# Altium schematic sheet Switch.SchDoc
size A; SheetNumber: 4; SheetTotal: 4
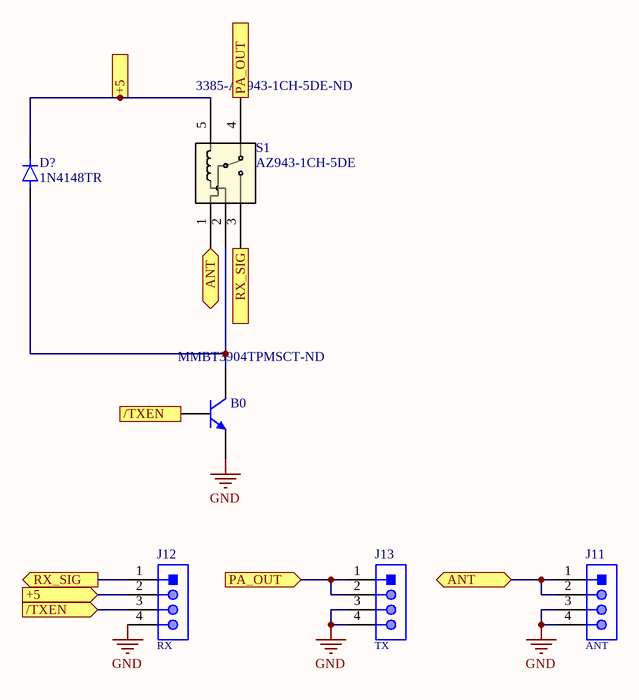
[diagram p0: Switch.SchDoc]

## Parts
B0  Supplier Part Number 1: MMBT3904TPMSCT-ND  (hidden comment: Bipolar NPN 3 Pins Transistor VBIC Model)
D?  1N4148TR  [DIOAD753W49L380D172B]
J11  ANT  [61300411121]
J12  RX  [61300411121]
J13  TX  [61300411121]
S1  AZ943-1CH-5DE  Supplier Part Number 1: 3385-AZ943-1CH-5DE-ND  [K_AZ943-1C_AMZ]

## Ports
+5 (in), /TXEN (in), ANT (bidir), PA_OUT (in), RX_SIG (out)

## Nets
GND: B0.3(E) J11.3 J11.4 J12.4 J13.3 J13.4
+5: D?.K J12.2 S1.5 ; port +5
/TXEN: B0.2(B) J12.3 ; port /TXEN
ANT: J11.1 J11.2 S1.1 ; port ANT
PA_OUT: J13.1 J13.2 S1.4 ; port PA_OUT
RX_SIG: J12.1 S1.3 ; port RX_SIG
NetB0_1: B0.1(C) D?.A S1.2

## Library data of the parts
B0 = BJT NPN VBIC: Small Signal Bipolar Transistor, 0.2A I(C), 40V V(BR)CEO, 1-Element, NPN, Silicon; Manufacturer: MCC; Manufacturer Part Number: MMBT3904-TP; SimulationGenericComponent: True; AFN: 1; AJC: -0.5; ART: 0.1; AVC1: 0; EA: 1.12; FC: 0.9; IBBE: 1e-06; IBCI: 1e-16; IBEI: 1e-18; MC: 0.33; NCN: 2; NKF: 0.5; PC: 0.75; TNOM: 27; VERS: 1.2; XII: 3; Package Body Material: Plastic; Max Collector Current: 200mA; DC Current Gain-Min (hFE): 30; Power Dissipation-Max (Abs): 350mW; Time @ Peak Reflow Temperature-Max (s): 10s; Transistor Application: AMPLIFIER; Transition Frequency-Nom (fT): 300MHz; Turn-off Time-Max (toff): 250ns; Turn-on Time-Max (ton): 70ns; Qualification Status: Not Qualified; AJE: -0.5; AJS: -0.5; AVC2: 0; BFN: 1; CBCO: 0; CBEO: 0; CCSO: 0; CJC: 0; CJCP: 0; CJE: 0; CJEP: 0; CTH: 0; DEAR: 0; EAIC: 1.12; EAIE: 1.12; EAIS: 1.12; EANC: 1.12; EANE: 1.12; EANS: 1.12; EAP: 1.12; EBBE: 0; GAMM: 0; HRCF: 1; IBCIP: 0; IBCN: 0; IBCNP: 0; IBEIP: 0; IBEN: 0; IBENP: 0; IKF: 0; IKP: 0; IKR: 0; IS: 1e-16; ISP: 0; ISRR: 1; ITF: 0; KFN: 0; ME: 0.33; MS: 0.33; NBBE: 1; NCI: 1; NCIP: 1; NCNP: 2; NEI: 1; NEN: 2; NF: 1; NFP: 1; NR: 1; PE: 0.75; PS: 0.75; QBM: 0; QCO: 0; QTF: 0; RBI: 0.1; RBP: 0.1; RBX: 0; RCI: 0.1; RCX: 0; RE: 0; RS: 0; RTH: 0; TAVC: 0; TD: 0; TF: 0; TNBBE: 0; TNF: 0; TR: 0; TVBBE1: 0; TVBBE2: 0; VBBE: 0; VEF: 0; VER: 0; VO: 0; VREF: 0; VRT: 0; VTF: 0; WBE: 1; WSP: 1; XIKF: 0; XIN: 3; XIS: 3; XISR: 0; XRBI: 0; XRBP: 0; XRBX: 0; XRCI: 0; XRCX: 0; XRE: 0; XRS: 0; XTF: 0; XVO: 0; Supplier 1: Digikey; RoHS: Yes; Category: BJTs; Stock 1: 2318719; Pricing 1: 1=0.1, 10=0.068, 100=0.0369, 500=0.02898, 1000=0.02012 (USD); Number of Pins: 3; Package Shape: Rectangular; Terminal Finish: Tin; Transistor Element Material: SILICON; Max Operating Temperature: 150°C; JESD-609 Code: e3; Polarity/Channel Type: NPN; Collector-emitter Voltage-Max: 40V; JESD-30 Code: R-PDSO-G3; Moisture Sensitivity Level: 1; Number of Elements: 1; Package Style: SMALL OUTLINEMeter; Peak Reflow Temperature (Cel): 260°C; Surface Mount: Yes; Terminal Form: Gull Wing; Terminal Position: DUAL; Reach SVHC Compliant: Yes; RoHS Compliant: Yes; ComponentLink1URL: https://datasheet.ciiva.com:443/pdfs/VipMasterIC/IC/MCCC/MCCC-S-A0009373541/MCCC-S-A0009372855-1.pdf?src-supplier=IHS+Markit; ComponentLink1Description: https://datasheet.ciiva.com:443/pdfs/VipMasterIC/IC/MCCC/MCCC-S-A0009373541/MCCC-S-A0009372855-1.pdf?src-supplier=IHS+Markit; ComponentLink2URL: https://datasheet.ciiva.com/16291/mmbt3904sot-23-37005-16291911.pdf?src-supplier=Mouser; ComponentLink2Description: https://datasheet.ciiva.com/16291/mmbt3904sot-23-37005-16291911.pdf?src-supplier=Mouser; ComponentLink3URL: https://datasheet.ciiva.com/15139/getdatasheetpartid-251950-15139820.pdf?src-supplier=Verical; ComponentLink3Description: https://datasheet.ciiva.com/15139/getdatasheetpartid-251950-15139820.pdf?src-supplier=Verical; ComponentLink4URL: https://datasheet.ciiva.com/972/mmbt3904sot-23-972515.pdf?src-supplier=Digikey; ComponentLink4Description: https://datasheet.ciiva.com/972/mmbt3904sot-23-972515.pdf?src-supplier=Digikey; ComponentLink5URL: https://datasheet.ciiva.com/14546/70055699-14546053.pdf?src-supplier=Allied+Electronics; ComponentLink5Description: https://datasheet.ciiva.com/14546/70055699-14546053.pdf?src-supplier=Allied+Electronics; ComponentLink6URL: https://datasheet.ciiva.com/16742/mmbt3904tsot-523-16742101.pdf?src-supplier=Future+Electronics; ComponentLink6Description: https://datasheet.ciiva.com/16742/mmbt3904tsot-523-16742101.pdf?src-supplier=Future+Electronics; ComponentLink7URL: https://datasheet.ciiva.com/972/mmbt3904sot-23-972516.pdf?src-supplier=Digikey; ComponentLink7Description: https://datasheet.ciiva.com/972/mmbt3904sot-23-972516.pdf?src-supplier=Digikey
D? = 1N4148TR: MF: {'manufacturer': u'onsemi'}; Package: None; Price: None; Value: *; MP: 1N4148TR; Availability: Unavailable
J11-J13 = CMP-1502-01064-1: THT Vertical Pin Header WR-PHD, Pitch 2.54 mm, Single Row, 4 pins; Manufacturer: Wurth Elektronik; Withstanding Voltage: 500VAC; Rated Current: 3A; Working Voltage: 250VAC; Pin Number: 4; Gender: Male; Contact Resistance: 20mOhm; Pitch: 2.54mm; Manufacturer URL: http://www.we-online.de; Operating Temperature: -40to105degC; Packaging: Bag; Mounting Technology: THT; Package Reference: 61300411121; Datasheet URL: https://katalog.we-online.de/em/datasheet/6130xx11121.pdf; Publisher: WurthElektronik; Part Number: 61300411121; Row Number: Single; Orientation: Vertical
S1 = AZ943-1CH-5DE: Power/Signal Relay, 1 Form C, SPDT, Latched, 6.5VDC (Coil), 10A (Contact), 30VDC (Contact), DC Input, Random, AC/DC Output; Mfr_Name: American Zettler; Manufacturer Series: AZ943; End Contact Material: Tin; Coil Operate Voltage(DC): 3.8V; Coil Resistance: 70R; Coil Voltage(DC)-Max: 6.5V; Coil Voltage-Nom: 5V; Contact AC Max Power Rating R Load: 2770VA@277VAC; Contact AC Max Rating R Load: 10A@277VAC; Contact DC Max Power Rating R Load: 210W@30VDC; Contact DC Max Rating R Load: 10A@30VDC; Contact Resistance: 100mR; Contact Voltage(AC)-Max: 277V; Contact Voltage(DC)-Max: 30V; Dielectric Strength Between Coil and Contacts: 1500Vrms; Dielectric Strength Between Open Contacts: 750Vrms; Electrical Life: 100000Cycles; Operate Time: 10ms; PCB Hole Count: 5; Relay Form: 1 FORM C; Release Time: 5ms; Body Breadth: 15.49inch; Body Height: 15.95mm; Body Length or Diameter: 19.25mm; Reference Standard: UL; Sealing: EPOXY; Type: Power Relays; RefDes: RefDes; Supplier 1: Digikey; Manufacturer: American Zettler; Manufacturer Part Number: AZ943-1CH-5DE; RoHS: Yes; Category: Power Relays; Stock 1: 17823; Pricing 1: 1=0.95, 20=0.8865, 40=0.7485, 100=0.709, 260=0.63023, 500=0.59084, 1000=0.55146, 5000=0.53176 (USD); Number of Pins: 5; Terminal Finish: Tin; Weight: 10g; Min Operating Temperature: -40°C; Max Operating Temperature: 90°C; JESD-609 Code: e3; Coil/Input Supply Type: DC; Contact Current(AC)-Max: 10A; Contact Current(DC)-Max: 10A; Contact/Output Supply Type: AC/DC; Input Switching Control Type: Random; Insulation Resistance: 100MR; Relay Action: LATCHED; Relay Function: SPDT; Termination: Solder; Relay Type: POWER/SIGNAL RELAY; Terminal Length: 0.0035inch; Reach SVHC Compliant: Yes; RoHS Compliant: Yes; ComponentLink1URL: https://datasheet.ciiva.com:443/pdfs/VipMasterIC/IC/AMZI/AMZI-S-A0001423067/AMZI-S-A0001423092-1.pdf?src-supplier=IHS+Markit; ComponentLink1Description: https://datasheet.ciiva.com:443/pdfs/VipMasterIC/IC/AMZI/AMZI-S-A0001423067/AMZI-S-A0001423092-1.pdf?src-supplier=IHS+Markit; ComponentLink2URL: http://www.onlinecomponents.com/productFiles/mf-AZ/az943.pdf?src-supplier=Onlinecomponents.com; ComponentLink2Description: http://www.onlinecomponents.com/productFiles/mf-AZ/az943.pdf?src-supplier=Onlinecomponents.com; ComponentLink3URL: https://www.alliedelec.com/m/d/1c61ec61dea3d5294db531adeb7ad978.pdf?src-supplier=Allied+Electronics; ComponentLink3Description: https://www.alliedelec.com/m/d/1c61ec61dea3d5294db531adeb7ad978.pdf?src-supplier=Allied+Electronics; ComponentLink4URL: http://www.azettler.com/pdfs/az943.pdf?src-supplier=Future+Electronics; ComponentLink4Description: http://www.azettler.com/pdfs/az943.pdf?src-supplier=Future+Electronics